# Altium schematic sheet Trap_PCB_SMT2024_N_N.SchDoc
size A3; SheetNumber: 1; SheetTotal: 1
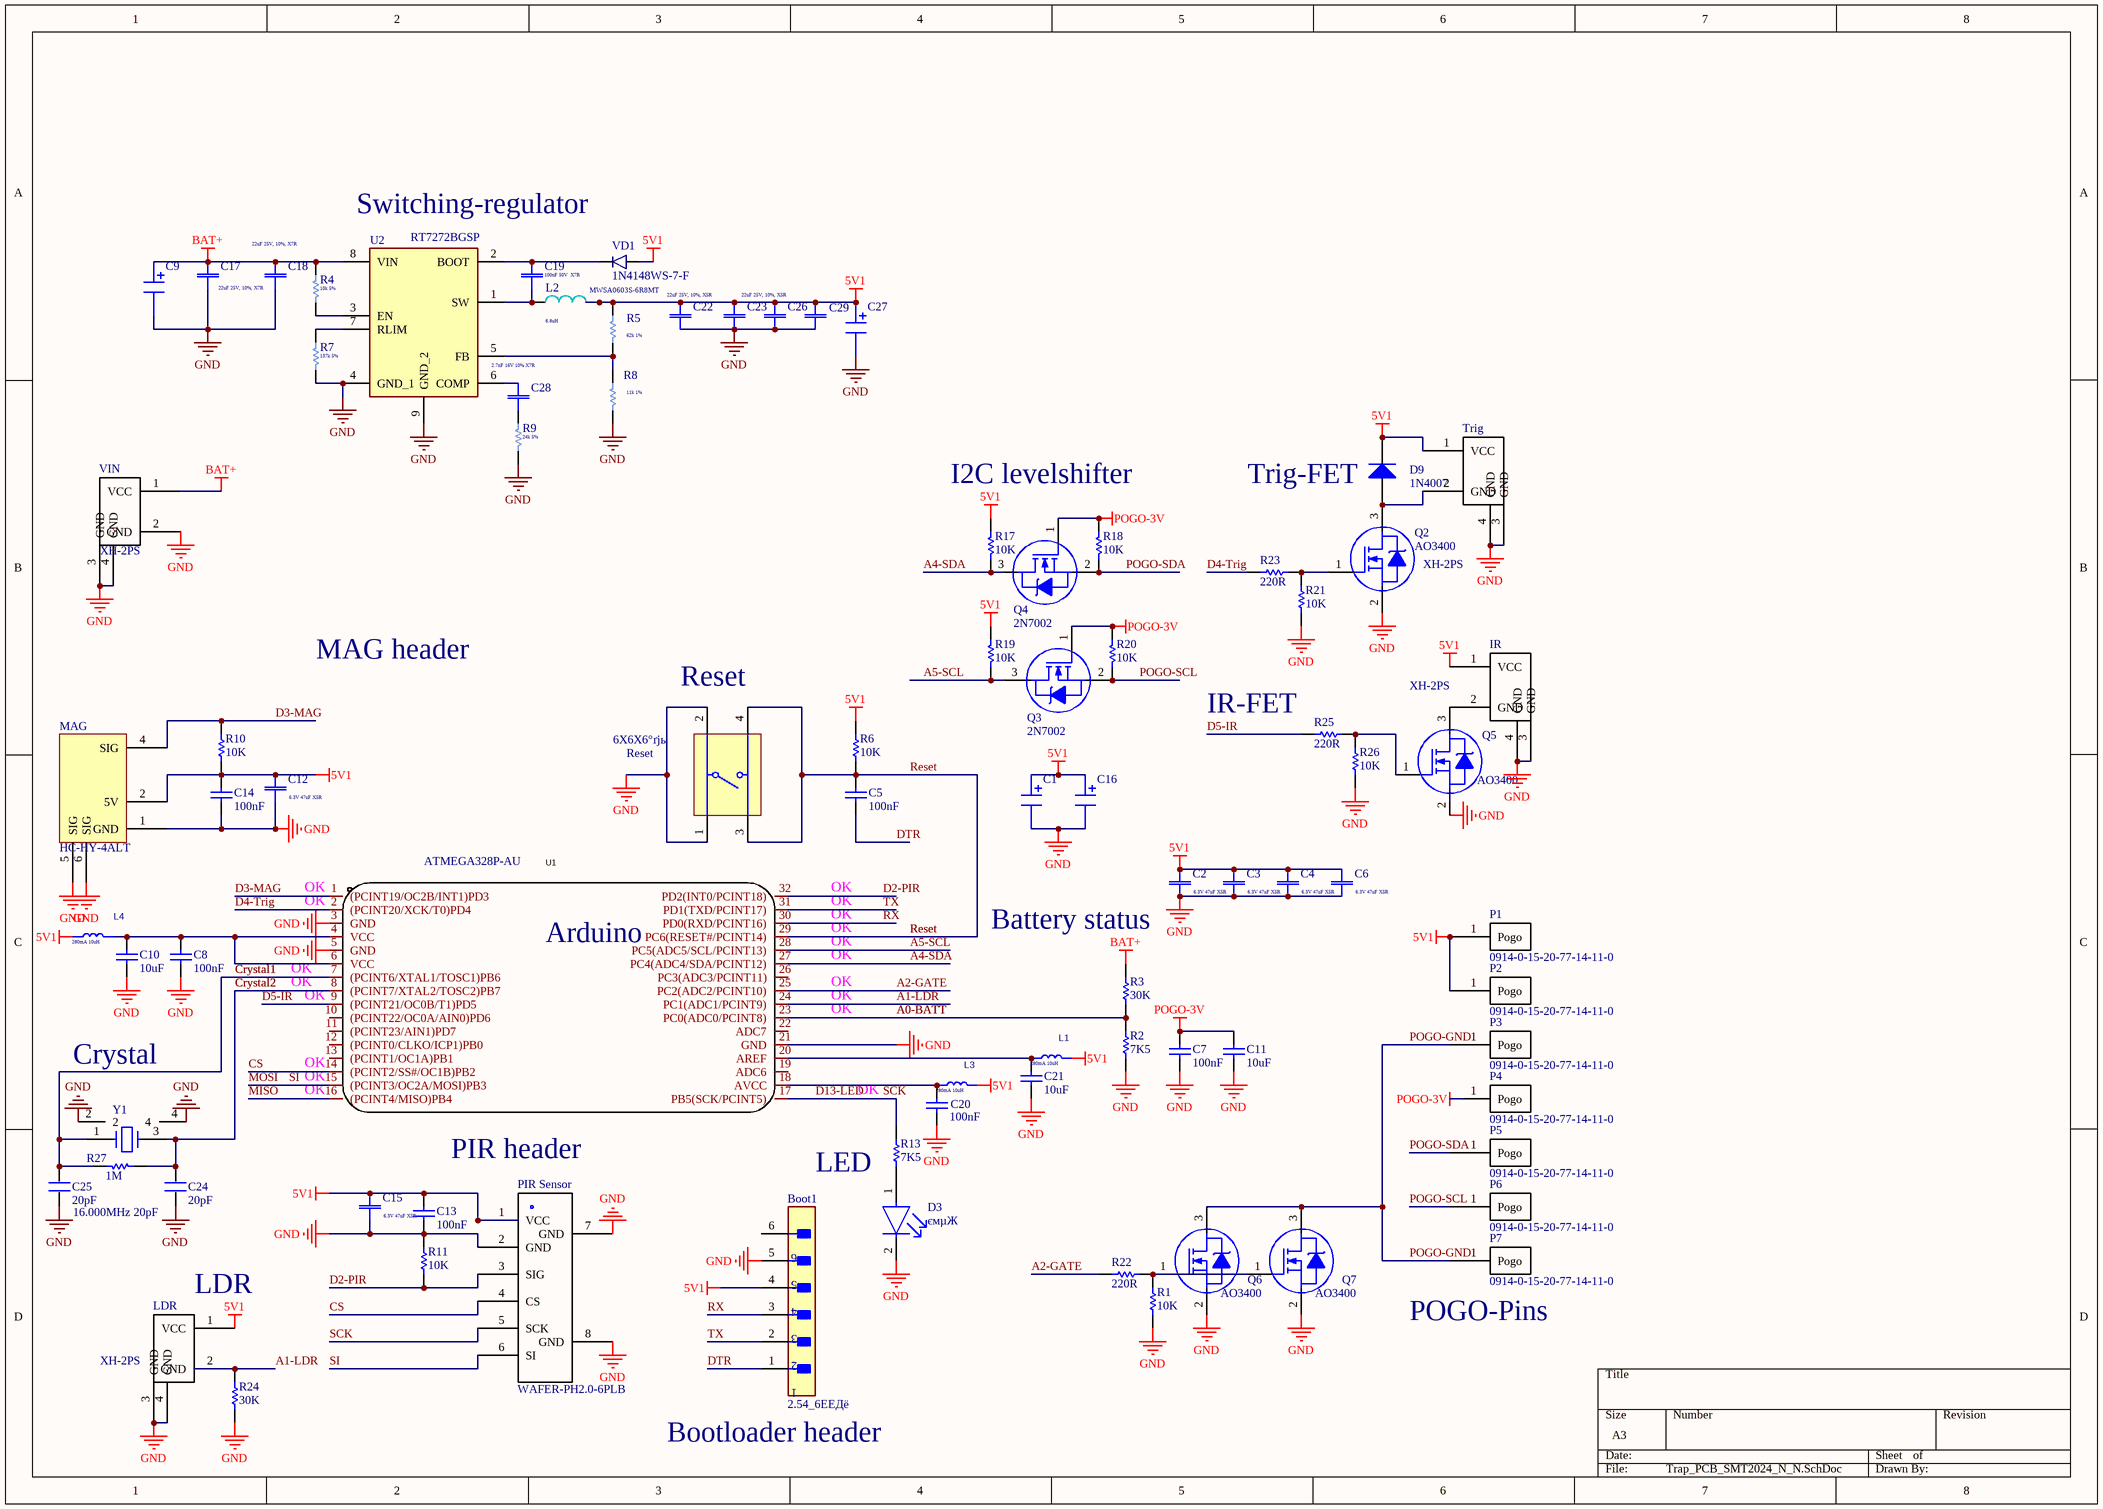
[diagram p0: Trap_PCB_SMT2024_N_N.SchDoc]

## Parts
Boot1  2.54_6ЕЕДё  [FP-SWR25X-NRTC-S06-ST-BA-MFG]
C1  NJCON 1026R30812R00  [Cap 8mm]  (value not drawn)
C2  6.3V 47uF X5R  [C0805(2013)]
C3  6.3V 47uF X5R  [C0805(2013)]
C4  6.3V 47uF X5R  [C0805(2013)]
C5  100nF  [0603C]
C6  6.3V 47uF X5R  [C0805(2013)]
C7  100nF  [0603C]
C8  100nF  [0603C]
C9  Honor Elec HS1C567M0811PC  [Cap 8mm]  (value not drawn)
C10  10uF  [0603C]
C11  10uF  [0603C]
C12  6.3V 47uF X5R  [C0805(2013)]
C13  100nF  [0603C]
C14  100nF  [0603C]
C15  6.3V 47uF X5R  [C0805(2013)]
C16  NJCON 1026R30812R00  [Cap 8mm]  (value not drawn)
C17  22uF 25V, 10%, X7R  [C1206(3216)]
C18  22uF 25V, 10%, X7R  [C1206(3216)]
C19  100nF 50V  X7R  [C0603(1608)]
C20  100nF  [0603C]
C21  10uF  [0603C]
C22  22uF 25V, 10%, X5R  [C0805(2013)]
C23  22uF 25V, 10%, X5R  [C0805(2013)]
C24  20pF  [0603C]
C25  20pF  [0603C]
C26  22uF 25V, 10%, X5R  [C0805(2013)]  (value not drawn)
C27  NJCON 1026R30812R00  [Cap 8mm]  (value not drawn)
C28  2.7nF 16V 10% X7R  [C0603(1608)]
C29  22uF 25V, 10%, X5R  [C0805(2013)]  (value not drawn)
D3  ємµЖ  [0603LED]
D9  1N4007  [SMA]
IR  XH-2PS  [CNS_2.5-2]
L1  value 280mA 10uH  [R0603]  (hidden comment: L-0603)
L2  MWSA0603S-6R8MT  value 6.8uH  [L (7.00mm x 6.60mm)]
L3  value 280mA 10uH  [R0603]  (hidden comment: L-0603)
L4  value 280mA 10uH  [R0603]  (hidden comment: L-0603)
LDR  XH-2PS  [CNS_2.5-2]
MAG  HC-HY-4ALT  [CNS_4P-P2.0]
P1  0914-0-15-20-77-14-11-0  [0914-0-15-20-77-14-11-0]
P2  0914-0-15-20-77-14-11-0  [0914-0-15-20-77-14-11-0]
P3  0914-0-15-20-77-14-11-0  [0914-0-15-20-77-14-11-0]
P4  0914-0-15-20-77-14-11-0  [0914-0-15-20-77-14-11-0]
P5  0914-0-15-20-77-14-11-0  [0914-0-15-20-77-14-11-0]
P6  0914-0-15-20-77-14-11-0  [0914-0-15-20-77-14-11-0]
P7  0914-0-15-20-77-14-11-0  [0914-0-15-20-77-14-11-0]
PIR_Sensor  WAFER-PH2.0-6PLB  [CNS-2.0-6]
Q2  AO3400  [SOT-23]
Q3  2N7002  [SOT-23]
Q4  2N7002  [SOT-23]
Q5  AO3400  [SOT-23]
Q6  AO3400  [SOT-23]
Q7  AO3400  [SOT-23]
R1  10K  [0603R]
R2  7K5  [0603R]
R3  30K  [0603R]
R4  10k 5%  [R0603]
R5  62k 1%  [R0603]
R6  10K  [0603R]
R7  137k 5%  [R0603]
R8  11k 1%  [R0603]
R9  24k 5%  [R0603]
R10  10K  [0603R]
R11  10K  [0603R]
R13  7K5  [0603R]
R17  10K  [0603R]
R18  10K  [0603R]
R19  10K  [0603R]
R20  10K  [0603R]
R21  10K  [0603R]
R22  220R  [0603R]
R23  220R  [0603R]
R24  30K  [0603R]
R25  220R  [0603R]
R26  10K  [0603R]
R27  1M  [0603R]
Reset  6X6X6°ґјь  [SW-4P-6X6]
Trig  XH-2PS  [CNS_2.5-2]
U1  ATMEGA328P-AU  [TQFP-32_L7.0-W7.0-P0.80-LS9.0-BL]
U2  RT7272BGSP  [SOIC8 +]
VD1  1N4148WS-7-F  [SOD-323]
VIN  XH-2PS  [CNS_2.5-2]
Y1  16.000MHz 20pF  [X3225]

## Nets
5V1: Boot1.4 C1.1 C2.2 C3.2 C4.2 C6.2 C12.2 C13.2 C14.2 C15.2 C16.1 C22.2 C23.2 C26.2 C27.1 C29.2 D9.2(K) IR.1(VCC) L1.2 L2.2 L3.2 L4.1 LDR.1(VCC) MAG.2(5V) P1.1(Pogo) P2.1(Pogo) PIR_Sensor.1(VCC) R5.1 R6.1 R10.2 R17.2 R19.2 Trig.1(VCC) VD1.2(A)
BAT+: C9.1 C17.2 C18.2 R3.1 R4.1 U2.8(VIN) VIN.1(VCC)
GND: Boot1.5 C1.2 C2.1 C3.1 C4.1 C6.1 C7.1 C8.1 C9.2 C10.1 C11.1 C12.1 C13.1 C14.1 C15.1 C16.2 C17.1 C18.1 C20.1 C21.1 C22.1 C23.1 C24.1 C25.1 C26.1 C27.2 C29.1 D3.2(A) IR.3(GND) IR.4(GND) LDR.3(GND) LDR.4(GND) MAG.1(GND) MAG.5(SIG) MAG.6(SIG) PIR_Sensor.2(GND) PIR_Sensor.7(GND) PIR_Sensor.8(GND) Q2.2 Q5.2 Q6.2 Q7.2 R1.1 R2.2 R7.2 R8.2 R9.2 R11.1 R21.1 R24.1 R26.1 Reset.1 Reset.2 Trig.3(GND) Trig.4(GND) U1.3(GND) U1.5(GND) U1.21(GND) U2.4(GND_1) U2.9(GND_2) VIN.2(GND) VIN.3(GND) VIN.4(GND) Y1.2 Y1.4
POGO-3V: C7.2 C11.2 P4.1(Pogo) Q3.1 Q4.1 R18.2 R20.2
A0-BATT: R2.1 R3.2 U1.23(PC0(ADC0/PCINT8))
A1-LDR: LDR.2(GND) R24.2 U1.24(PC1(ADC1/PCINT9))
A2-GATE: R22.2 U1.25(PC2(ADC2/PCINT10))
A4-SDA: Q4.3 R17.1 U1.27(PC4(ADC4/SDA/PCINT12))
A5-SCL: Q3.3 R19.1 U1.28(PC5(ADC5/SCL/PCINT13))
Crystal1: C25.2 R27.2 U1.7((PCINT6/XTAL1/TOSC1)PB6) Y1.1
Crystal2: C24.2 R27.1 U1.8((PCINT7/XTAL2/TOSC2)PB7) Y1.3
CS: PIR_Sensor.4(CS) U1.14((PCINT2/SS#/OC1B)PB2)
D2-PIR: PIR_Sensor.3(SIG) R11.2 U1.32(PD2(INT0/PCINT18))
D3-MAG: MAG.4(SIG) R10.1 U1.1((PCINT19/OC2B/INT1)PD3)
D4-Trig: R23.2 U1.2((PCINT20/XCK/T0)PD4)
D5-IR: R25.2 U1.9((PCINT21/OC0B/T1)PD5)
D13-LED: PIR_Sensor.5(SCK) R13.2 U1.17(PB5(SCK/PCINT5))  [also labelled SCK]
DTR: Boot1.1 C5.1
MISO: U1.16((PCINT4/MISO)PB4)
MOSI: PIR_Sensor.6(SI) U1.15((PCINT3/OC2A/MOSI)PB3)  [also labelled SI]
POGO-GND: P3.1(Pogo) P7.1(Pogo) Q6.3 Q7.3
POGO-SCL: P6.1(Pogo) Q3.2 R20.1
POGO-SDA: P5.1(Pogo) Q4.2 R18.1
Reset: C5.2 R6.2 Reset.3 Reset.4 U1.29(PC6(RESET#/PCINT14))
RX: Boot1.3 U1.30(PD0(RXD/PCINT16))
TX: Boot1.2 U1.31(PD1(TXD/PCINT17))
NetC8_2: C8.2 C10.2 L4.2 U1.4(VCC) U1.6(VCC)
NetC19_1: C19.1 L2.1 U2.1(SW)
NetC19_2: C19.2 U2.2(BOOT) VD1.1(K)
NetC20_2: C20.2 L3.1 U1.18(AVCC)
NetC21_2: C21.2 L1.1 U1.20(AREF)
NetC28_1: C28.1 R9.1
NetC28_2: C28.2 U2.6(COMP)
NetD3_1: D3.1(C) R13.1
NetD9_1: D9.1(A) Q2.3 Trig.2(GND)
NetIR_2: IR.2(GND) Q5.3
NetQ2_1: Q2.1 R21.2 R23.1
NetQ5_1: Q5.1 R25.1 R26.2
NetQ6_1: Q6.1 Q7.1 R1.2 R22.1
NetR4_2: R4.2 U2.3(EN)
NetR5_2: R5.2 R8.1 U2.5(FB)
NetR7_1: R7.1 U2.7(RLIM)

Not connected (* = marked no-connect by the designer): Boot1 6; U1 10((PCINT22/OC0A/AIN0)PD6) 11((PCINT23/AIN1)PD7) 12((PCINT0/CLKO/ICP1)PB0) 13((PCINT1/OC1A)PB1) 19(ADC6) 22(ADC7) 26(PC3(ADC3/PCINT11))

## Notes on the sheet
- Switching-regulator
- I2C levelshifter
- (near D9) Trig-FET
- MAG header
- (near Reset) Reset
- (near R25) IR-FET
- (near U1) OK
- OK
- (near U1) Arduino
- (near C2) Battery status
- Crystal
- PIR header
- LED
- (near LDR) LDR
- (near P7) POGO-Pins
- (near Boot1) Bootloader header

## Library data of the parts
Boot1 = f2cb566baf1c37ab5a3b8e90bbeafd6: CONN HEADER VERT 6POS 2.54MM; Manufacturer: Sullins; Conn Orientation: Straight; Current Rating: 3A; Temperature Range High: +85ЎгC; Number Of Rows: 1; ComponentLink2URL: https://drawings-pdf.s3.amazonaws.com/11633.pdf; Octopart: https://octopart.com/swr25x-nrtc-s06-st-ba-sullins-20912730; RoHS: TRUE; Lead Free: Yes; Digikey Description: CONN HEADER VERT 6POS 2.54MM; Temperature: -25ЎгC to +85ЎгC; ComponentLink2Description: Datasheet; Category: Conn; Device Class L1: Connectors; Package: SWR25X-NRTC-S06-ST-BA; Pitch: 2.54mm
C1 C9 C16 C27 = CAP 8mm
C2-C4 C6 C12 C15 C22 C23 C26 C29 = C-0805: SMD-0805; Type: CAP
  C2-C4 C6 C12 C15: Value: 6.3V 47uF X5R
  C22 C23 C26 C29: Value: 22uF 25V, 10%, X5R
C5 C7 C8 C10 C11 C13 C14 C20 C21 = CAP-NP-2: Capacitor, Ceramic, 22 pF, +/-10 %, 100 V, -55 to 125 degC, 2-Pin THD, RoHS, Bulk; Max Input Voltage: 40 V; Min Input Voltage: 4.2 V; Output Current: 1.5 A; RoHSCompliant: true; Min Operating Temperature: 0 degC; Max Operating Temperature: 125 degC; Package Quantity: 50; ComponentLink2URL: http://capacitoredge.kemet.com/capedge2/DataSheet/Datasheet-C315C220K1G5TA.pdf?pn=C315C220K1G5TA{BULK}; Radiation Hardening: No; Pins: 3; Length: 10.28 mm; ComponentLink1URL: http://www.kemet.com/; ComponentLink2Description: Datasheet; Height: 9.28 mm; REACH SVHC: No SVHC; ComponentLink1Description: Manufacturer URL
C17 C18 = C-1206: SMD-1206; Type: CAP; Value: 22uF 25V, 10%, X7R
C19 C28 = C-0603: SMD-0603; Type: CAP
  C19: Value: 100nF 50V  X7R
  C28: Value: 2.7nF 16V 10% X7R
C24 C25 = C
D3 = 8706943c75ba83719d021d2fdc84c58: LED YELLOW DIFFUSED T-1 T/H; Manufacturer: Broadcom; Wavelength: 585nm; Led Orientation: Straight; Luminous Intensity: 2.1mcd; Forward Voltage: 1.8V; Viewing Angle: 50Ўг; Lead Free: Yes; Automotive: No; Device Class L1: Optoelectronics; Mouser Description: Standard LEDs - Through Hole Yellow Diffused 585nm 2.1mcd; Digikey Description: LED YELLOW DIFFUSED T-1 T/H; Temperature: -40ЎгC to +100ЎгC; Temperature Range High: +100ЎгC; Package: 0; Category: Diode; Colour: Yellow
D9 = Diode: Default Diode; Published: 8-Jun-2000; LatestRevisionDate: 17-Jul-2002; LatestRevisionNote: Re-released for DXP Platform.; PackageVersion: Sep-1996; PackageReference: SMC; Publisher: Altium Limited; PackageDescription: DO-214-AB/SMC; 2 C-Bend Leads; Body 7.9 x 5.9 mm, inc. leads (LxW); Code_JEDEC: DO-214-AB
IR LDR Trig VIN = JST HXP2
L1 L3 L4 = L-0603: FTW1608FE100KT
L2 = MWSA0603S-6R8MT: 6.8uH 5A 48mΩ SMD (7.00mm x 6.60mm); Type: SMD Bead; ComponentLink1Description: INDUCTOR; ComponentLink1URL: https://www.lcsc.com/product-detail/Power-Inductors_APV-APH0530T6R8M_C5349684.html
MAG = MAG Sensor
P1-P7 = 0914-0-15-20-77-14-11-0: CONTACT SPRING LOADED T/H GOLD
PIR_Sensor = JST - PH-6p - 2.0mm
Q2-Q7 = IRF640N
R1 R6 R10 R11 R17-R21 R26 = RES-2: Little Demon(R) Carbon Composition Molded OD Series, 250 V, 10 KOhm, +/-5%, -70 to 130 degC, 2-Pin THD, RoHS, Bulk; Power Rating: 0.25W; Power (Watts): 0.25W,1/4W; Tolerance: ЎА5%; Online Catalog: OD,OF,OASeries,LittleDemon?; Mounting Technology: ThroughHole; Datasheet Version: 06/2016; RoHS Information: LittleDemon"E"SeriesMaterialDeclaration; Number of Terminations: 2; Temperature Coefficient: -; Height: -; Resistance (Ohms): 10k; Composition: CarbonComposition; Package Description: 2-Pin THD Resistor, Body 7 x 2.5 mm, Lead Dia. 0.6 mm; Size / Dimension: 0.098"Diax0.276"L(2.50mmx7.00mm); Category: Resistors; Manufacturer URL: http://www.ohmite.com/
R2 R3 R13 R22-R25 = RES-2: Little Demon(R) Carbon Composition Molded OD Series, 250 V, 10 KOhm, +/-5%, -70 to 130 degC, 2-Pin THD, RoHS, Bulk; Resistance (Ohms): 10k; Power Rating: 0.25W; Power (Watts): 0.25W,1/4W; Tolerance: ЎА5%; Online Catalog: OD,OF,OASeries,LittleDemon?; Mounting Technology: ThroughHole; Datasheet Version: 06/2016; RoHS Information: LittleDemon"E"SeriesMaterialDeclaration; Number of Terminations: 2; Temperature Coefficient: -; Height: -; Composition: CarbonComposition; Package Description: 2-Pin THD Resistor, Body 7 x 2.5 mm, Lead Dia. 0.6 mm; Size / Dimension: 0.098"Diax0.276"L(2.50mmx7.00mm); Category: Resistors; Manufacturer URL: http://www.ohmite.com/
R4 R5 R7-R9 = R-0603: SMD 0603 0.1W 5% 50V; Type: RES
  R4: Value: 10k 5%
  R5: Value: 62k 1%
  R7: Value: 137k 5%
  R8: Value: 11k 1%
  R9: Value: 24k 5%
R27 = Res1: Resistor; Value: 1K; Published: 8-Jun-2000; Revision: July-2002: Re-released for DXP Platform.; Publisher: Altium Limited
Reset = SW-SPST-4_A: Tactile Switch, SPST-NO, 0.05 A, 5 to 24 V, -25 to 70 degC, 4-Pin THD, RoHS, Bulk; Shielding: Shielded; Gender: Female; Radiation Hardening: No; Contact Plating: Gold; Height: 14.99 mm; Min Operating Temperature: -40 degC; Packaging: Tray; ComponentLink2Description: Datasheet; ComponentLink1URL: http://www.omron.com/; Lead Pitch: 1.27 mm; RoHSCompliant: true; Pins: 8; PackageReference: B3F-1000; Width: 25.4 mm; Contact Material: Brass; ComponentLink2URL: http://www.omron.com/ecb/products/pdf/en-b3f.pdf
U1 = ATMEGA328P-AU: Add into BOM: yes; CPU Core: AVR; Program Storage Size: 32KB; RAM Size: 2KB; GPIO Ports Number: 23; Operating Voltage Range: 1.8V~5.5V; CPU Maximum Speed: 20MHz; Program Memory Type: FLASH; EEPROM: 1KB; ADC (Bit): 10bit; Symbol: ATMEGA328P-AU; Device: ATMEGA328P-AU; Supplier Part: C14877; Manufacturer Part: ATMEGA328P-AU; Supplier Footprint: TQFP-32(7x7); JLCPCB Part Class: Extended Part; Datasheet: https://atta.szlcsc.com/upload/public/pdf/source/20140621/1457707095197.pdf; Supplier: LCSC; Convert to PCB: yes; DAC (Bit): -; PWM (Bit): -; 8Bit Timer: -; 16Bit Timer: -; 32Bit Timer: -; CAN: -; UART/USART: -; I2C: -; I2S: -; SPI: -; Universal Serial Bus: -; Internal Comparator: -; communication protocol: -; Real-Time Clock: -; Infrared Data Association: -; CCP Capture/Compare: -; LCD Module: -; LED Module: -; Secure Digital Input and Output: -; Direct Memory Access: -; Application Area: -
U2 = RT7272BGSP: Buck Switching Regulator IC Positive Adjustable 0.8V 1 Output 3A 8-SOIC (0.154, 3.90mm Width) Exposed Pad; MF: Richtek USA; Package: SOP-8 Richtek; Price: None; Check_prices: https://www.snapeda.com/parts/RT7272BGSP/Richtek+USA+Inc./view-part/?ref=eda; Value: *; SnapEDA_Link: https://www.snapeda.com/parts/RT7272BGSP/Richtek+USA+Inc./view-part/?ref=snap; MP: RT7272BGSP; Availability: In Stock; Purchase-URL: https://pricing.snapeda.com/search?q=RT7272BGSP&ref=eda
VD1 = 1N4148WS-7-F: Diode Switching 150mA 75V 200mW SOD323 Diodes Inc 1N4148WS-7-F Switching Diode, 150mA 75V, 2-Pin SOD-323; Type: Diode
Y1 = R25010031: R25010031/№¤ТµC/Пы·СA/ѕ§МеХсµґЖч/8.000M/20pF/ЎА30ppm/49USM/ROHS/-10Ўж~+70Ўж; Ч°ЕдАаРН: SMD; ОпБПГиКц: ѕ§МеХсµґЖч/8.000M/20pF/ЎА30ppm/49USM/ROHS/-10Ўж~+70Ўж; ОпБП±аВл: R25010031; УЕСЎµИј¶: №¤ТµC/Пы·СA